# Altium schematic sheet P01_BCS1_Power BBCore.SchDoc
size A3; Date: 24.11.2011; CheckedBy: Finke; Author: Mierau; DrawnBy: Mierau; SheetNumber: 1; SheetTotal: 8; Anlage: 78; Beschreibung: Qseven; Kunde: 56; ProjektName: BCS1; ProjektNummer: 88xxx; Ersatz_fuer: 12; ersetzt_durch: 34; LKNummer: 6190202; ID_Nummer: 90
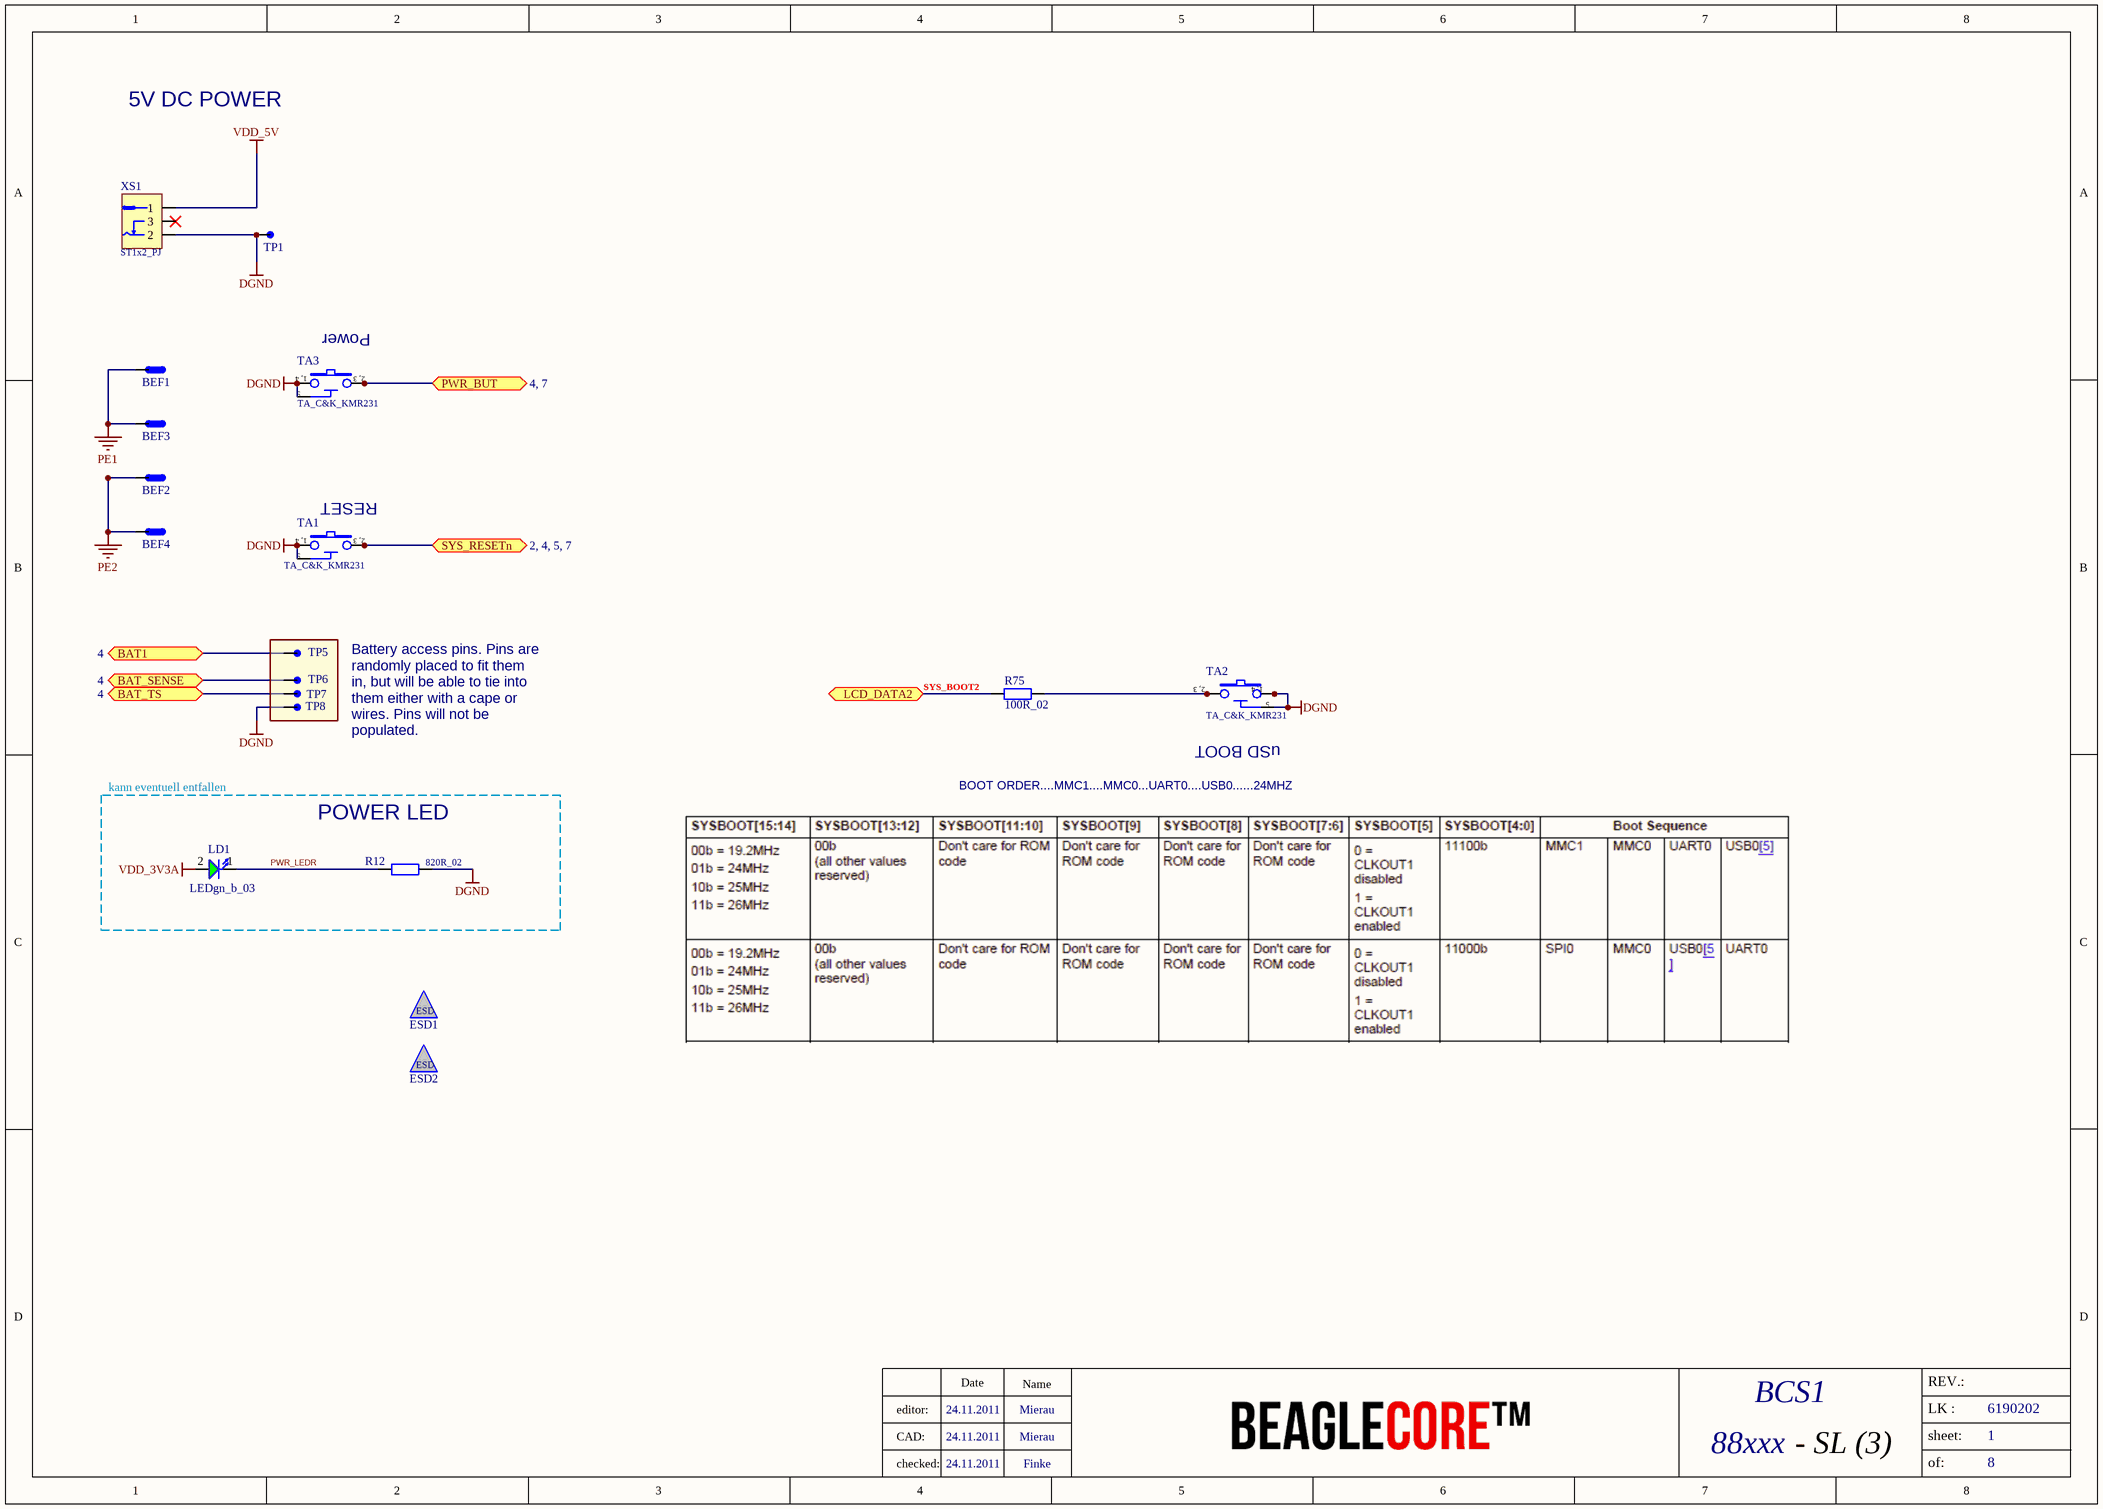
[diagram p0: P01_BCS1_Power BBCore.SchDoc]

## Parts
BEF1  BEF_3.2_4.45  [BEF_3.2_4.45]  (value not drawn)  (no BOM)
BEF2  BEF_3.2_4.45  [BEF_3.2_4.45]  (value not drawn)  (no BOM)
BEF3  BEF_3.2_4.45  [BEF_3.2_4.45]  (value not drawn)  (no BOM)
BEF4  BEF_3.2_4.45  [BEF_3.2_4.45]  (value not drawn)  (no BOM)
ESD1  ESD  [ESD_G]  (value not drawn)  (no BOM)
ESD2  ESD  [ESD_G]  (value not drawn)  (no BOM)
LD1  LEDgn_b_03  [CD1608-0603]
R12  820R_02  [CR1005-0402]
R75  100R_02  [CR1005-0402]
TA1  TA_C&K_KMR231  [TA_KMR2]
TA2  TA_C&K_KMR231  [TA_KMR2]
TA3  TA_C&K_KMR231  [TA_KMR2]
TP1  TP THT  [TP mit 0.8mm Bohrung]  (value not drawn)  (no BOM)
TP5  TP THT  [TP mit 0.8mm Bohrung]  (value not drawn)  (no BOM)
TP6  TP THT  [TP mit 0.8mm Bohrung]  (value not drawn)  (no BOM)
TP7  TP THT  [TP mit 0.8mm Bohrung]  (value not drawn)  (no BOM)
TP8  TP THT  [TP mit 0.8mm Bohrung]  (value not drawn)  (no BOM)
XS1  ST1x2_PJ  [ST1X2THT-2mm-DC_WA]

## Blocks framed on the sheet
POWER LED: LD1 R12

## Ports
BAT1 (see 4), BAT_SENSE (see 4), BAT_TS (see 4), LCD_DATA2, PWR_BUT (see 4, 7), SYS_RESETn (see 2, 4, 5, 7)

## Nets
DGND: R12.2 TA1.1 TA1.4 TA1.5 TA2.1 TA2.4 TA2.5 TA3.1 TA3.4 TA3.5 TP1.1(Pin) TP8.1(Pin) XS1.2
PE1: BEF1.1(Pin) BEF3.1(Pin)
PE2: BEF2.1(Pin) BEF4.1(Pin)
VDD_3V3A: LD1.2(A)
VDD_5V: XS1.1
BAT1: TP5.1(Pin) ; port BAT1
BAT_SENSE: TP6.1(Pin) ; port BAT_SENSE
BAT_TS: TP7.1(Pin) ; port BAT_TS
LCD_DATA2: R75.1 ; port LCD_DATA2
PWR_BUT: TA3.2 TA3.3 ; port PWR_BUT
PWR_LEDR: LD1.1(K) R12.1
SYS_RESETn: TA1.2 TA1.3 ; port SYS_RESETn
NetR75_2: R75.2 TA2.2 TA2.3

Not connected (* = marked no-connect by the designer): XS1 3*

## Notes on the sheet
- 5V DC POWER
- (near TA3) Power
- (near TA1) RESET
- (near R75) SYS_BOOT2
- Battery access pins. Pins are randomly placed to fit them in, but will be able to tie into them either with a cape or wires. Pins will not be populated.
- BOOT ORDER....MMC1....MMC0...UART0....USB0......24MHZ
- (near TA2) uSD BOOT
- kann eventuell entfallen
- Date
- Name
- REV.:
- editor:
- CAD:
- - SL (3)
- sheet:
- LK :
- checked:
- of:
- (in symbol TASTER_C&K_KMR231) 1, 4; 2, 3

## Library data of the parts
BEF1-BEF4 = A_BEF_3.2_4.45: Befestigungsbohrung D=3.2mm_4.45_Rand; Value: BEF_3.2_4.45
ESD1 ESD2 = A_ESD: ESD Symbol; Value: ESD
LD1 = LD_LEDgn_bright_03: Leuchtdiode bright grün 0603, RV(5mA)@3V3= 100OHM; Hersteller: Würth Elektronik; Bestellbezeichnung: 150060VS75000; Value: LEDgn_b_03
R12 = R820R_02: Resistor 0402; Value: 820R_02
R75 = R100R_02: Resistor 0402 1%; Value: 100R_02
TA1-TA3 = TASTER_C&K_KMR231: Taster smd 1pol mm pitch, 4.6x2.8mm case; Hersteller: C&K; Bestellbezeichnung: KMR231GLFS; Value: TA_C&K_KMR231
TP1 TP5-TP8 = TP1.6 mit Bohrung 0.8: Testpunkt rund mit Bohrung D=0.8mm; Value: TP THT
  TP5-TP8: Revision: *
XS1 = XST1X2_PJ_WA: DC-Power-Jack, 2mm Stift, 5A, THT,gew.; Hersteller: CUI; Bestellbezeichnung: PJ-002AH; Value: ST1x2_PJ